# Altium schematic sheet Pag5_Perifericos.SchDoc
size A4
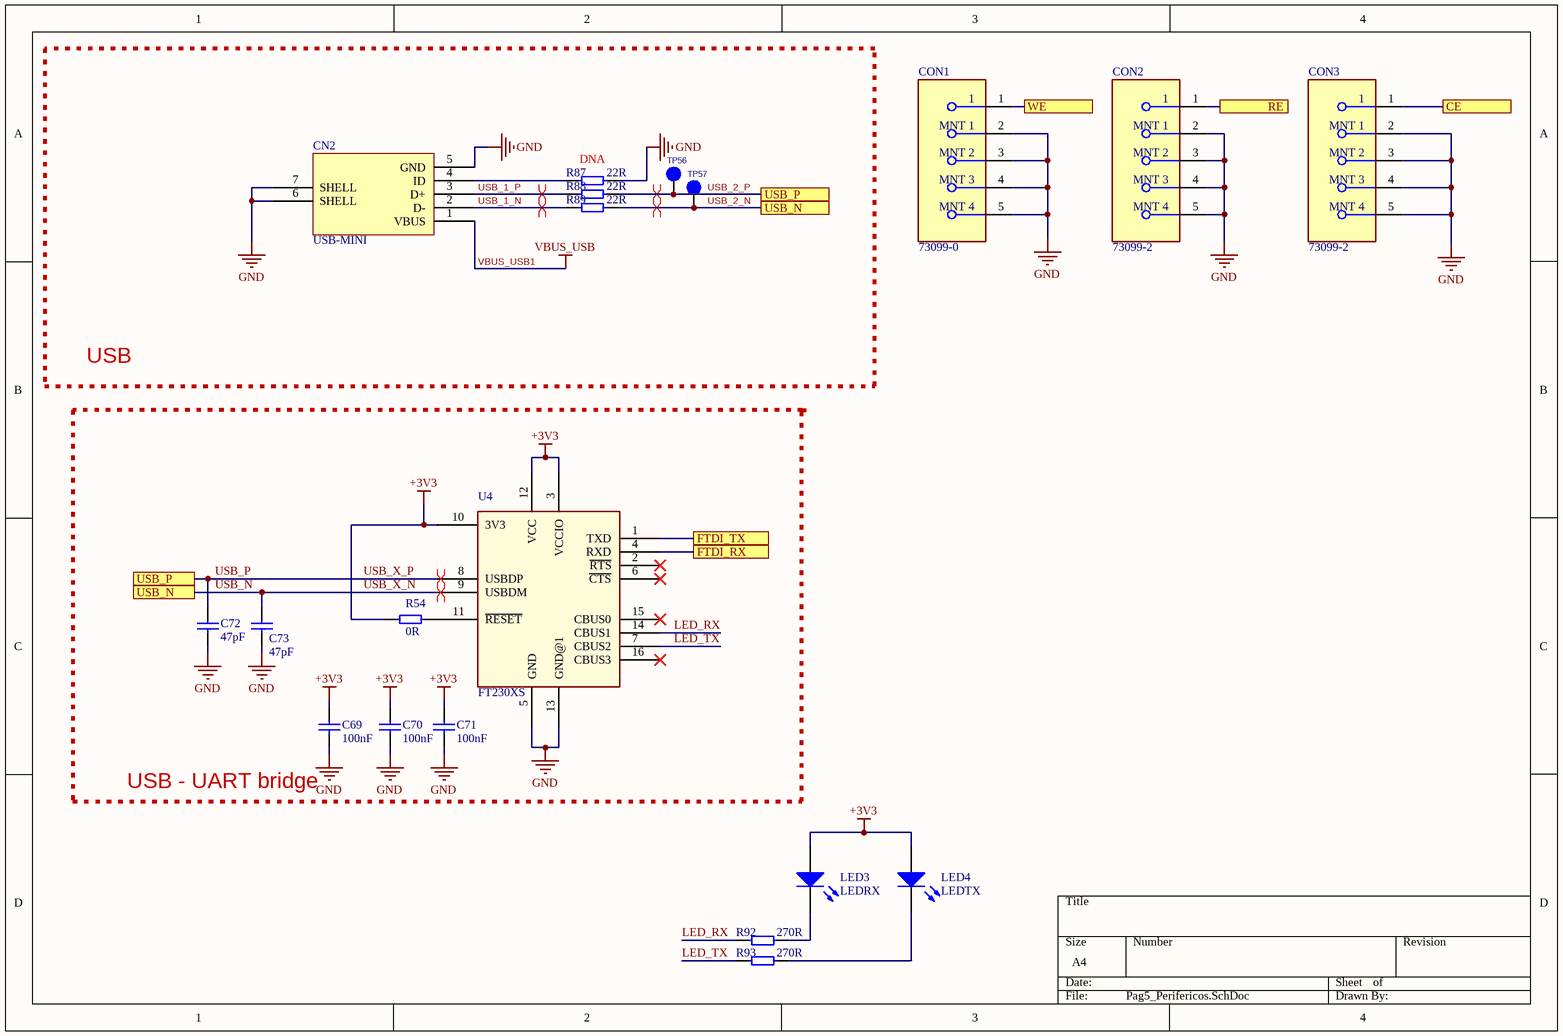
[diagram p0: Pag5_Perifericos.SchDoc]

## Parts
C69  100nF  [0603]
C70  100nF  [0603]
C71  100nF  [0603]
C72  47pF  [0603]
C73  47pF  [0603]
CN2  USB-MINI  [TE_2172034-1]
CON1  73099-0  [FP-73099-0-MFG]
CON2  73099-2  [FP-73099-2-MFG]
CON3  73099-2  [FP-73099-2-MFG]
LED3  LEDRX  [0603 - LED]
LED4  LEDTX  [0603 - LED]
R54  0R  [0603]
R87  22R  PCBA: DNA  [0603]
R88  22R  [0603]
R89  22R  [0603]
R92  270R  [0603]
R93  270R  [0603]
TP56  Test_Point  [TEST]  (value not drawn)
TP57  Test_Point  [TEST]  (value not drawn)
U4  FT230XS  [SSOP-16-2]

## Blocks framed on the sheet
USB: CN2 R87-R89 TP56 TP57

## Ports
CE, FTDI_RX, FTDI_TX, RE, USB_N, USB_P, WE

## Nets
+3V3: C69.2 C70.2 C71.2 LED3.1(A) LED4.1(A) R54.2 U4.3(VCCIO) U4.10(3V3) U4.12(VCC)
GND: C69.1 C70.1 C71.1 C72.1 C73.1 CN2.5(GND) CN2.6(SHELL) CN2.7(SHELL) CON1.2(MNT_1) CON1.3(MNT_2) CON1.4(MNT_3) CON1.5(MNT_4) CON2.2(MNT_1) CON2.3(MNT_2) CON2.4(MNT_3) CON2.5(MNT_4) CON3.2(MNT_1) CON3.3(MNT_2) CON3.4(MNT_3) CON3.5(MNT_4) R87.1 U4.5(GND) U4.13(GND@1)
VBUS_USB1: CN2.1(VBUS)  [also labelled VBUS_USB]
CE: CON3.1 ; port CE
FTDI_RX: U4.4(RXD) ; port FTDI_RX
FTDI_TX: U4.1(TXD) ; port FTDI_TX
LED_RX: R92.1 U4.14(CBUS1)
LED_TX: R93.1 U4.7(CBUS2)
RE: CON2.1 ; port RE
USB_1_N: CN2.2(D-) R89.2
USB_1_P: CN2.3(D+) R88.2
USB_2_N: C73.2 R89.1 TP57.1(Pin1) U4.9(USBDM) ; port USB_N  [also labelled USB_N, USB_X_N]
USB_2_P: C72.2 R88.1 TP56.1(Pin1) U4.8(USBDP) ; port USB_P  [also labelled USB_P, USB_X_P]
WE: CON1.1 ; port WE
NetCN2_4: CN2.4(ID) R87.2
NetLED3_2: LED3.2(K) R92.2
NetLED4_2: LED4.2(K) R93.2
NetR54_1: R54.1 U4.11(~{RESET})

Not connected (* = marked no-connect by the designer): U4 2(~{RTS})* 6(~{CTS})* 15(CBUS0)* 16(CBUS3)*

## Layout directives
differential pair: USB_1_N, USB_1_P, USB_2_N, USB_2_P

## Notes on the sheet
- (near C69) USB - UART bridge

## Library data of the parts
C69-C71 = Cap: Multilayer Ceramic Capacitors MLCC - SMD/SMT 100nF 16V 0603 10%; Manufacturer: KEMET; MPN: C0603C104K4RACTU; PCBA: Assembly; Moeda: Dólar; NCM: 85322410; Value: 100nF; Link/Contato: https://octopart.com/c0603c104k4ractu-kemet-93067?r=sp; Supplier: Mouser
C72 C73 = Cap: Multilayer Ceramic Capacitors MLCC - SMD/SMT 47pF 0603 25V 5%; Manufacturer: Vishay; MPN: VJ0603A470JXXPW1BC; PCBA: Assembly; Moeda: Dólar; NCM: 85322410; Value: 47pF; Link/Contato: https://octopart.com/vj0603a470jxxpw1bc-vishay-40999950?r=sp; Supplier: Mouser
CN2 = USB-MINI: Standard LEDs - SMD 0603 SMT CHIP LED 572nm; MPN: 2172034-1; Manufacturer: TE Connectivity AMP Connectors; PCBA: Assembly; Moeda: Dólar; NCM: 85366990; Datasheet: https://www.te.com/commerce/DocumentDelivery/DDEController?Action=srchrtrv&DocNm=2172034&DocType=Customer+Drawing&DocLang=English; Value: USB-MINI; Link/Contato: https://octopart.com/2172034-1-te+connectivity+%2F+amp-34548161?r=sp; Supplier: Mouser
CON1 = CMP-73906-000007-1: R/A 4MM MOUNTG SAFE JACK/PCB BLK; Manufacturer: Pomona Electronics; PCBA: Assembly; Moeda: Dólar; NCM: 85366990; Value: 73099-0; MPN: 73099-0; Link/Contato: https://octopart.com/73099-0-pomona+electronics-104944164?r=sp; Supplier: Mouser
CON2 CON3 = CMP-73906-000005-1: R/A 4MM MOUNTG SAFE JACK/PCB RED; Manufacturer: Pomona Electronics; PCBA: Assembly; Moeda: Dólar; NCM: 85366990; Value: 73099-2; MPN: 73099-2; Link/Contato: https://octopart.com/73099-2-pomona+electronics-104944165?r=sp; Supplier: Mouser
LED3 LED4 = LED: Standard LEDs - SMD 0603 SMT CHIP LED 572nm; Manufacturer: ROHM Semiconductor; MPN: SML-D13M8WT86; PCBA: Assembly; Moeda: Dólar; NCM: 85414121; Link/Contato: https://octopart.com/sml-d13m8wt86-rohm-24399183?r=sp; Supplier: Mouser
  LED3: Value: LEDRX
  LED4: Value: LEDTX
R54 = Pullup_Res_0_0603_RES: Thick Film Resistors - SMD 0 Ohms 100 mW 0603 5%; MPN: RC0603JR-070RL; Manufacturer: Yageo; PCBA: Assembly; Moeda: Dólar; NCM: 85332120; Datasheet: https://www.mouser.com/datasheet/2/447/PYu-RC_Group_51_RoHS_L_10-1527934.pdf; Value: 0R; Link/Contato: https://octopart.com/rc0603jr-070rl-yageo-1241539?r=sp; Supplier: Mouser
R87 = Res: Thin Film Resistors - SMD 22Ohms 0603 100mW 1%; Manufacturer: Yageo; MPN: RT0603FRE0722RL; Moeda: Dólar; NCM: 85332120; Datasheet: https://www.mouser.com/datasheet/2/447/PYu-RC_Group_51_RoHS_L_10-1527934.pdf; Value: 22R; Link/Contato: https://octopart.com/rt0603fre0722rl-yageo-39814074?r=sp; Supplier: Mouser
R88 R89 = Res: Thin Film Resistors - SMD 22Ohms 0603 100mW 1%; Manufacturer: Yageo; MPN: RT0603FRE0722RL; PCBA: Assembly; Moeda: Dólar; NCM: 85332120; Datasheet: https://www.mouser.com/datasheet/2/447/PYu-RT_1-to-0.01_RoHS_L_9-1222720.pdf; Value: 22R; Link/Contato: https://octopart.com/rt0603fre0722rl-yageo-39814074?r=sp; Supplier: Mouser
R92 R93 = Res: Thick Film Resistors - SMD 270 Ohms 0603 100mW 1%; Manufacturer: Yageo; MPN: RC0603FR-07270RL; PCBA: Assembly; Moeda: Dólar; NCM: 85332120; Value: 270R; Link/Contato: https://octopart.com/rc0603fr-07270rl-yageo-9288890?r=sp; Supplier: Mouser
TP56 TP57 = CDO08200-9892: Manufacturer: DNA; Value: Test Point; MPN: Test_Point; PCBA: DNA
U4 = FT230XS: I/F, USB2.0 FS TO BASIC UART, 16SSOP; USB Type: Transceiver; USB Version: 2.0; Data Rate: 3Mbaud; Supply Voltage Rang...; Manufacturer: FTDI; PCBA: Assembly; Moeda: Dólar; NCM: 85423120; MPN: FT230XS; Value: FT230XS; Link/Contato: https://octopart.com/ft230xs-r-ftdi-22061505?r=sp; Supplier: Mouser